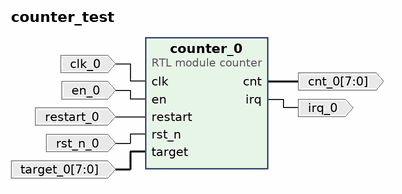
[diagram p0: block diagram of the top level]
# Vivado block design counter_test, xczu3eg-sbva484-1-i, Vivado 2020.2
create_bd_design counter_test

create_bd_port -dir I -type clk clk_0
create_bd_port -dir O -from 7 -to 0 cnt_0
create_bd_port -dir I en_0
create_bd_port -dir O -type intr irq_0
create_bd_port -dir I restart_0
create_bd_port -dir I -type rst rst_n_0
create_bd_port -dir I -from 7 -to 0 target_0

create_bd_cell -type module -reference counter counter_0

# ---- connections ----

connect_bd_net -net clk_0_1 [get_bd_ports clk_0] [get_bd_pins counter_0/clk]
connect_bd_net [get_bd_pins counter_0/cnt] [get_bd_ports cnt_0]
connect_bd_net -net en_0_1 [get_bd_ports en_0] [get_bd_pins counter_0/en]
connect_bd_net [get_bd_pins counter_0/irq] [get_bd_ports irq_0]
connect_bd_net -net restart_0_1 [get_bd_ports restart_0] [get_bd_pins counter_0/restart]
connect_bd_net -net rst_n_0_1 [get_bd_ports rst_n_0] [get_bd_pins counter_0/rst_n]
connect_bd_net -net target_0_1 [get_bd_ports target_0] [get_bd_pins counter_0/target]

validate_bd_design
save_bd_design
